# EAGLE design breakout (EAGLE 6.5.0)
Combined 74HC595 & ULN2003A breakout board.
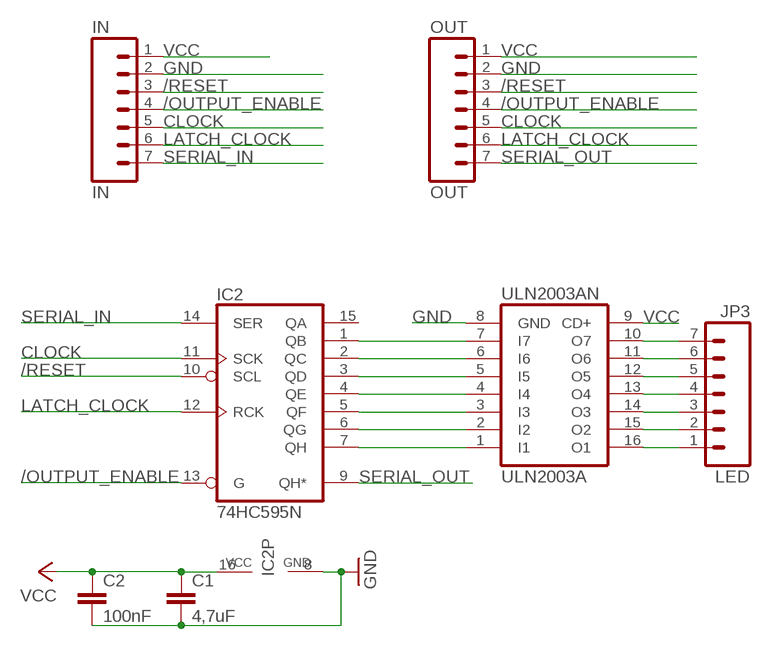
[diagram p0: schematic, sheet 1]

## Parts
C1  4,7uF  C-EU025-024X044  [C025-024X044]
C2  100nF  C-EU025-024X044  [C025-024X044]
IC2  74HC595N  [DIL16]
IN  IN  M07  [1X07]
JP3  LED  M07  [1X07]
OUT  OUT  M07  [1X07]
ULN2003A  ULN2003AN  [DIL16]

## Nets
/OUTPUT_ENABLE: IC2.13(G) IN.4 OUT.4
/RESET: IC2.10(SCL) IN.3 OUT.3
CLOCK: IC2.11(SCK) IN.5 OUT.5
GND: C1.2 C2.2 IC2.8(GND) IN.2 OUT.2 ULN2003A.8(GND)
LATCH_CLOCK: IC2.12(RCK) IN.6 OUT.6
N$1: IC2.1(QB) ULN2003A.7(I7)
N$2: IC2.2(QC) ULN2003A.6(I6)
N$3: IC2.3(QD) ULN2003A.5(I5)
N$4: IC2.4(QE) ULN2003A.4(I4)
N$5: IC2.5(QF) ULN2003A.3(I3)
N$6: IC2.6(QG) ULN2003A.2(I2)
N$7: IC2.7(QH) ULN2003A.1(I1)
N$8: JP3.7 ULN2003A.10(O7)
N$9: JP3.6 ULN2003A.11(O6)
N$10: JP3.5 ULN2003A.12(O5)
N$11: JP3.4 ULN2003A.13(O4)
N$12: JP3.3 ULN2003A.14(O3)
N$13: JP3.2 ULN2003A.15(O2)
N$14: JP3.1 ULN2003A.16(O1)
SERIAL_IN: IC2.14(SER) IN.7
SERIAL_OUT: IC2.9(QH*) OUT.7
VCC: C1.1 C2.1 IC2.16(VCC) IN.1 OUT.1 ULN2003A.9(CD+)
Unconnected: IC2.15(QA)

## Library data of the parts
C1 C2 = rcl:C-EU: CAPACITOR, European symbol
IC2 = 74xx-eu:74*595: 8-bit SHIFT REGISTER, output latch
IN JP3 OUT = SparkFun-Connectors:M07: Header 7 Standard 7-pin 0.1" header. Use with straight break away headers (SKU : PRT-00116), right angle break away headers (PRT-00553), swiss pins (PRT-00743), machine pins (PRT-00117), and female headers (PRT-00115). NOTES ON THE VARIANTS LOCK and LOCK_LONGPADS... This footprint was designed to help hold the alignment of a through-hole component (i.e. 7-pin header) while soldering it into place. You may notice that each hole has been shifted either up or down by 0.005 of an inch from it's more standard position (which is usually a perfectly straight line). This slight alteration caused the pins (the squares in the middle) to touch the edges of the holes. Because they are alternating, it causes a "brace" to hold the header in place. 0.005 has proven to be the perfect amount of "off-center" position when using our standard breakaway headers. Although looks a little odd when you look at the bare footprint, once you have a header in there, the alteration is very hard to notice. Also, if you push a header all the way into place, it is covered up entirely on the bottom side. This idea of altering the position of holes to aid alignment will be further integrated into the Sparkfun Library for other footprints. It can help hold any component with 3 or more connection pins.
ULN2003A = uln-udn:ULN2003A: DRIVER ARRAY

## Board
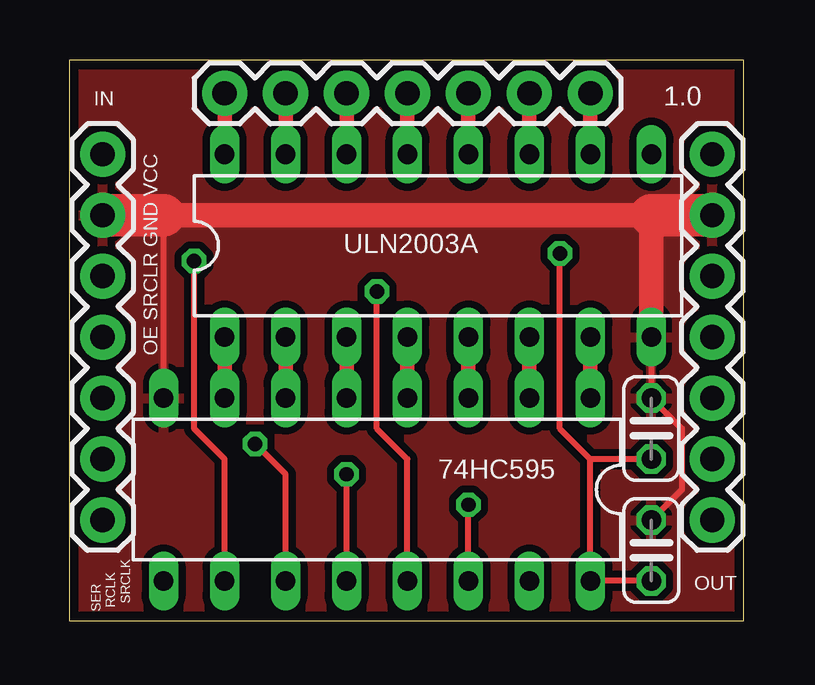
[diagram p1: board, top side]
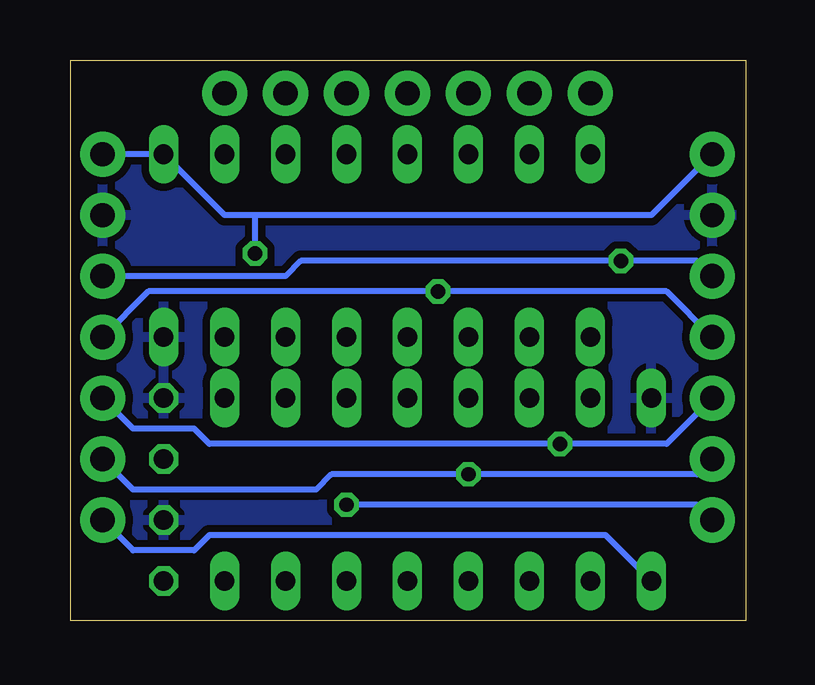
[diagram p2: board, bottom side, seen from below]

Size 28.12 x 23.36 mm. Coordinates in mm from the lower left corner, seen from the top.
Outline: 0,0 28.12,0 28.12,23.36 0,23.36 0,0
Copper layers (1*16): Top 0.0356mm / dielectric 1.5011mm / Bottom 0.0356mm
Design rules "laenPCBOrder": minimum track width 6mil, minimum drill 13mil, track to track 6mil, track to pad 6mil, pad to pad 6mil, via to via 6mil, smd to smd 6mil, copper to edge 15mil, drill to drill 6mil, minimum pad ring 7mil, minimum via ring 7mil, stop-mask expansion 3mil, vias tented up to drill 0mil, thermal gap 10mil

### Footprints (pad centres in the part's own frame; a part is rotated, then mirrored left to right if it is on the bottom)
C025-024X044 = drill 0.813 octagon: 1 -1.27,0; 2 1.27,0
DIL16 = drill 0.813 long: 1 -8.89,-3.81; 2 -6.35,-3.81; 3 -3.81,-3.81; 4 -1.27,-3.81; 5 1.27,-3.81; 6 3.81,-3.81; 7 6.35,-3.81; 8 8.89,-3.81; 9 8.89,3.81; 10 6.35,3.81; 11 3.81,3.81; 12 1.27,3.81; 13 -1.27,3.81; 14 -3.81,3.81; 15 -6.35,3.81; 16 -8.89,3.81
1X07 = drill 1.016 pad 1.88: 1 0,0; 2 2.54,0; 3 5.08,0; 4 7.62,0; 5 10.16,0; 6 12.7,0; 7 15.24,0

### Placement (x,y rotation side)
C1  24.26,2.92 90 top
C2  24.26,8 90 top
IC2  12.83,5.46 180 top
IN  1.4,19.43 270 top
JP3  6.48,21.97 0 top
OUT  26.8,19.43 270 top
ULN2003A  15.37,15.62 0 top

### Tracks (layer width: path | path; a pad name or v marks a point on that pad's centre or on a via)
/OUTPUT_ENABLE  (via drill 0.6 pad 1.02)
  Top 0.254: IC2.13 14.1,6.73 12.83,8 v12.83,13.72
  Bottom 0.254: IN.4 3.3,13.72 v12.83,13.72 24.89,13.72 OUT.4
/RESET  (via drill 0.6 pad 1.02)
  Top 0.254: IC2.10 6.48,6.73 5.21,8 v5.21,14.99
  Bottom 0.254: IN.3 2.03,14.99 v5.21,14.99 18.54,14.99 19.18,14.35 OUT.3
CLOCK  (via drill 0.6 pad 1.02)
  Top 0.254: IC2.11 9.02,6.1 v7.75,7.37
  Bottom 0.254: IN.5 3.3,7.37 v7.75,7.37 22.35,7.37 22.99,8 25.53,8 OUT.5
GND
  Top 0.254: IC2.8 3.94,16.89 | ULN2003A.8 C2.2 25.53,8 25.53,5.46 C1.2
  Top 1.016: 3.94,16.89 24.26,16.89 ULN2003A.8
  Top 1.778: IN.2 3.94,16.89 | 24.26,16.89 OUT.2
  pour Top (isolate 0.305): 0,0 0,23.37 28.19,23.37 28.19,0
  pour Bottom (isolate 0.305): 0,0 0,23.37 28.19,23.37 28.19,0
LATCH_CLOCK  (via drill 0.6 pad 1.02)
  Top 0.254: IC2.12 v11.56,6.1
  Bottom 0.254: IN.6 2.03,6.1 v11.56,6.1 17.27,6.1 17.91,5.46 25.53,5.46 OUT.6
N$1
  Top 0.61: IC2.1 ULN2003A.7
N$2
  Top 0.61: ULN2003A.6 IC2.2
N$3
  Top 0.61: IC2.3 ULN2003A.5
N$4
  Top 0.61: ULN2003A.4 IC2.4
N$5
  Top 0.61: ULN2003A.3 IC2.5
N$6
  Top 0.61: ULN2003A.2 IC2.6
N$7
  Top 0.61: ULN2003A.1 IC2.7
N$8
  Top 0.61: JP3.7 ULN2003A.10
N$9
  Top 0.61: JP3.6 ULN2003A.11
N$10
  Top 0.61: JP3.5 ULN2003A.12
N$11
  Top 0.61: JP3.4 ULN2003A.13
N$12
  Top 0.61: JP3.3 ULN2003A.14
N$13
  Top 0.61: JP3.2 ULN2003A.15
N$14
  Top 0.61: JP3.1 ULN2003A.16
SERIAL_IN  (via drill 0.6 pad 1.02)
  Top 0.254: IC2.14 v16.64,4.83
  Bottom 0.254: IN.7 2.03,4.83 v16.64,4.83
SERIAL_OUT
  Bottom 0.254: IC2.9 5.84,3.56 22.35,3.56 22.99,2.92 25.53,2.92 OUT.7
VCC  (via drill 0.6 pad 1.02)
  Top 0.254: 21.72,6.73 IC2.16 C1.1 | 21.72,6.73 20.45,8 v20.45,15.3 | C2.1 21.72,6.73
  Bottom 0.254: OUT.1 ULN2003A.9 21.72,16.89 20.45,16.89 | IN.1 3.94,16.89 20.45,16.89 | v20.45,15.3 20.45,16.89

### Text on the board
tPlace: IN | 1.0 | ULN2003A | OE SRCLR GND VCC | 74HC595 | OUT | SER / RCLK / SRCLK